# EAGLE schematic SeanOptoIsolatorCircuit (EAGLE 9.5.1)
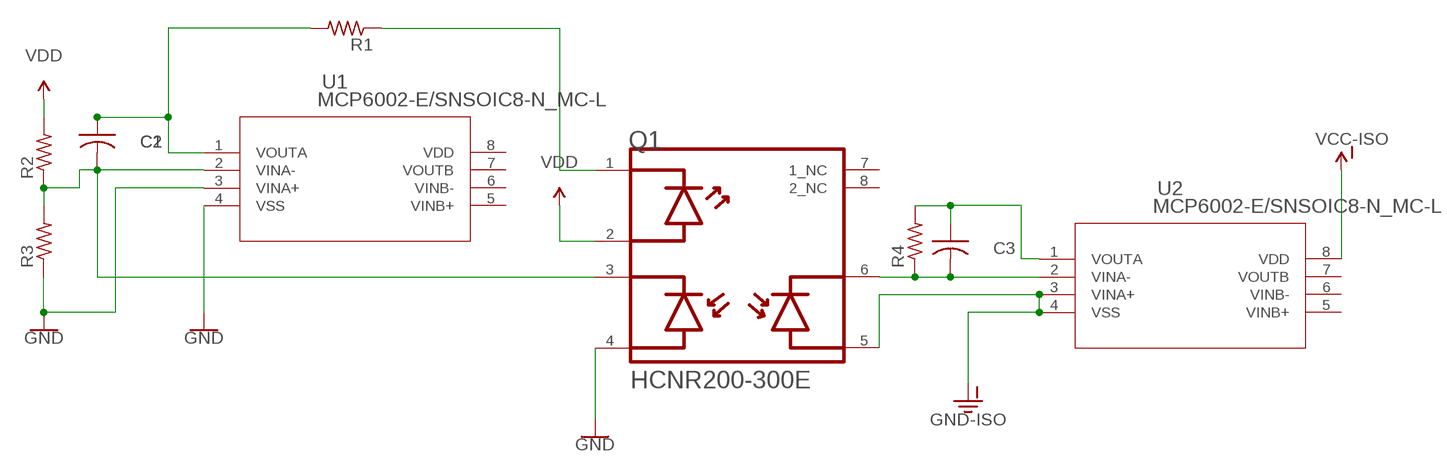
[diagram p0: schematic, sheet 1]

## Parts
C1  C-US025-024X044  [C025-024X044]
C2  C-US025-024X044  [C025-024X044]
C3  C-US025-024X044  [C025-024X044]
Q1  BROADCOM_HCNR200-300EBROADCOM_HCNR200-300E_0_0  [BROADCOM_HCNR200-300E_0]
R1  R-US_0204/5  [0204/5]
R2  R-US_0204/5  [0204/5]
R3  R-US_0204/5  [0204/5]
R4  R-US_0204/5  [0204/5]
U1  MCP6002-E/SNSOIC8-N_MC-L  [SOIC8-N_MC-L]
U2  MCP6002-E/SNSOIC8-N_MC-L  [SOIC8-N_MC-L]

## Nets
GND: Q1.4(PD1_ANODE) R3.1 U1.3(VINA+) U1.4(VSS)
GND-ISO: Q1.5(PD2_ANODE) U2.3(VINA+) U2.4(VSS)
N$1: C1.2 C2.2 Q1.3(PD1_CATHODE) R2.1 R3.2 U1.2(VINA-)
N$2: C1.1 C2.1 R1.2 U1.1(VOUTA)
N$3: Q1.1(LED_CATHODE) R1.1
N$4: C3.2 Q1.6(PD2_CATHODE) R4.1 U2.2(VINA-)
N$5: C3.1 R4.2 U2.1(VOUTA)
VCC-ISO: U2.8(VDD)
VDD: Q1.2(LED_ANODE) R2.2
Unconnected: Q1.7(1_NC) Q1.8(2_NC) U1.5(VINB+) U1.6(VINB-) U1.7(VOUTB) U1.8(VDD) U2.5(VINB+) U2.6(VINB-) U2.7(VOUTB)

## Library data of the parts
C1-C3 = adafruit:C-US: CAPACITOR, American symbol
Q1 = Broadcom - HCNR200-300E:BROADCOM_HCNR200-300E: OPTOISO 5KV LINEAR PHVOLT 8DIPGW; AUTOMOTIVE: No; CENTROID_NOT_SPECIFIED: No; DATASHEET: https://docs.broadcom.com/docs/AV02-0886EN; DEVICE_CLASS_L1: Optoelectronics; DEVICE_CLASS_L2: Optocouplers; DEVICE_CLASS_L3: unset; DIGIKEY_DESCRIPTION: OPTOISO 5KV LINEAR PHVOLT 8DIPGW; DIGIKEY_PART_NUMBER: 516-1608-5-ND; FOOTPRINT_VARIANT_NAME_0: Recommended_Land_Pattern; FORWARD_CURRENT: 10mA; FORWARD_VOLTAGE: 1.6V; HEIGHT: 5mm; ISOLATION_VOLTAGE: 5000Vrms; LEAD_FREE: Yes; MAX_CURRENT_TRANSFER_RATIO: 0.75%; MAX_JUNCTION_TEMP: +125°C; MF: Broadcom; MFG_PACKAGE_IDENT: 0; MFG_PACKAGE_IDENT_DATE: 0; MFG_PACKAGE_IDENT_REV: 0; MIN_CURRENT_TRANSFER_RATIO: 0.25%; MOUSER_DESCRIPTION: Optocoupler DC-IN 1-CH Linear Photovoltaic DC-OUT 8-Pin PDIP W SMD Tube; MOUSER_PART_NUMBER: 630-HCNR200-300E; MPN: HCNR200-300E; PACKAGE: DIP8 GULL WING; POWER_DISSIPATION: 60mW; PREFIX: Q; REVERSE_VOLTAGE: 2.5V; ROHS: Yes; STANDOFF_HEIGHT: 0.5mm; TEMPERATURE_RANGE_HIGH: +85°C; TEMPERATURE_RANGE_LOW: -40°C; VERIFICATION_VERSION: 0.0.0.3
R1-R4 = adafruit:R-US_: RESISTOR, American symbol
U1 U2 = MCP6002:MCP6002-E/SN; BUILT_BY: EMA_Jessica; COPYRIGHT: Copyright (C) 2018 Accelerated Designs. All rights reserved; MANUFACTURER_PART_NUMBER: MCP6002-E/SN; VENDOR: Microchip